# EAGLE design interfaceBoard (EAGLE 7.2.0)
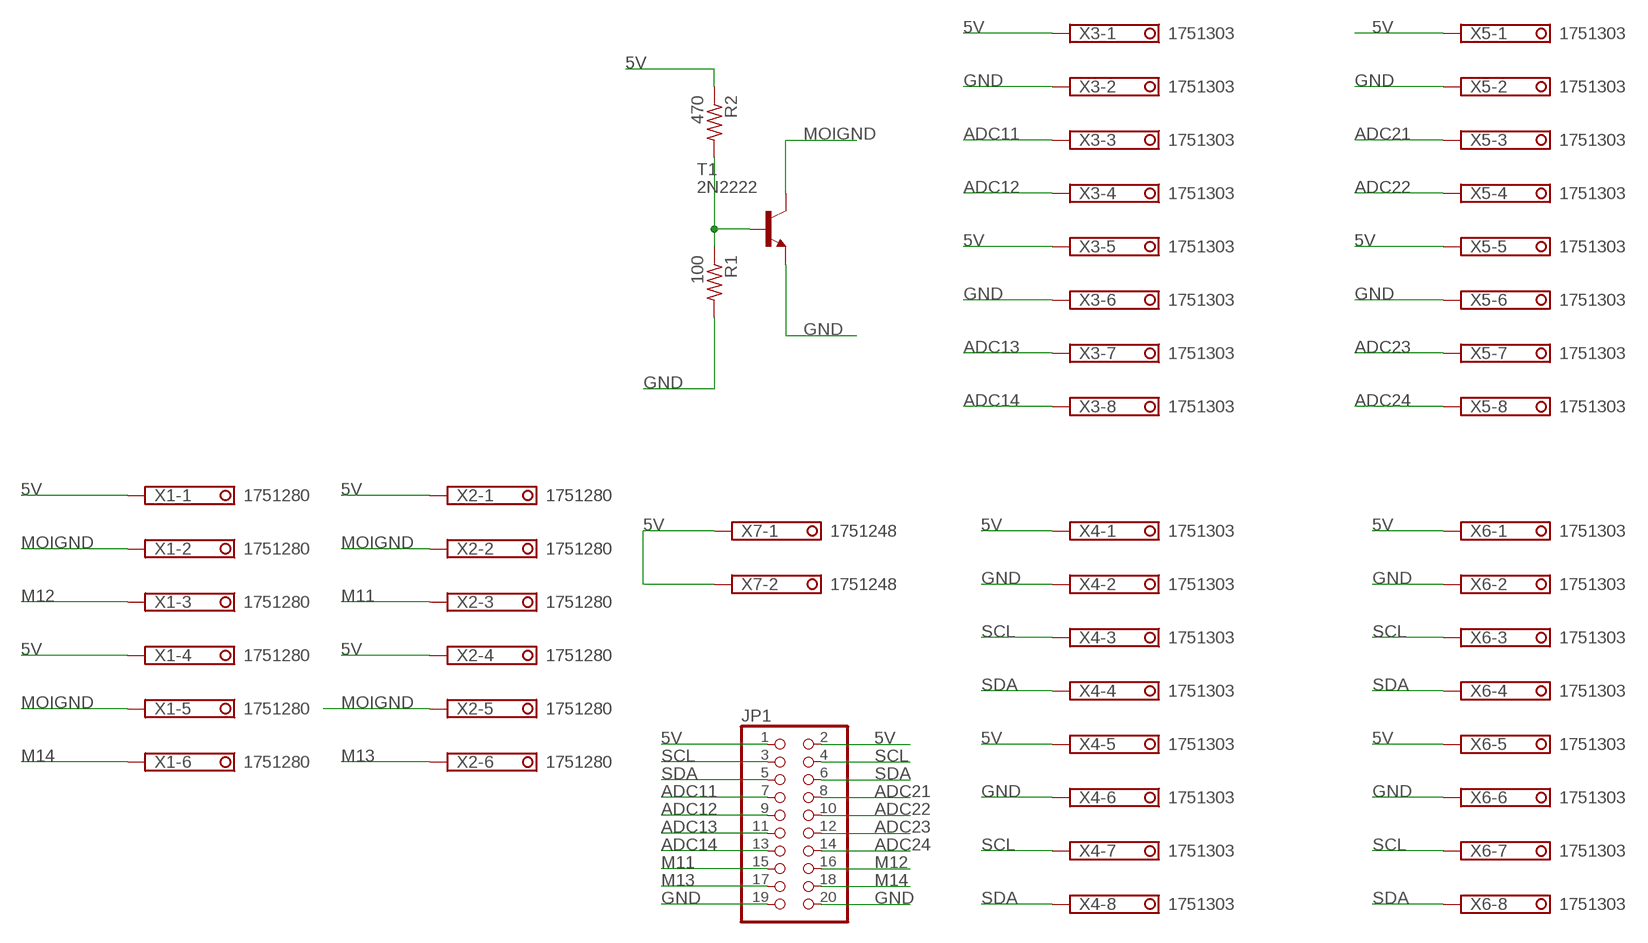
[diagram p0: schematic, sheet 1]

## Parts
JP1  PINHD-2X10  [2X10]
R1  100  R-US_M0805  [M0805]
R2  470  R-US_M0805  [M0805]
T1  2N2222  [TO92-EBC-OVAL]
X1  1751280  [1751280]
X2  1751280  [1751280]
X3  1751303  [1751303]
X4  1751303  [1751303]
X5  1751303  [1751303]
X6  1751303  [1751303]
X7  1751248  [1751248]

## Nets
5V: JP1.1 JP1.2 R2.1 X1.1 X1.4 X2.1 X2.4 X3.1 X3.5 X4.1 X4.5 X5.1 X5.5 X6.1 X6.5 X7.1 X7.2
ADC11: JP1.7 X3.3
ADC12: JP1.9 X3.4
ADC13: JP1.11 X3.7
ADC14: JP1.13 X3.8
ADC21: JP1.8 X5.3
ADC22: JP1.10 X5.4
ADC23: JP1.12 X5.7
ADC24: JP1.14 X5.8
GND: JP1.19 JP1.20 R1.2 T1.E X3.2 X3.6 X4.2 X4.6 X5.2 X5.6 X6.2 X6.6
M11: JP1.15 X2.3
M12: JP1.16 X1.3
M13: JP1.17 X2.6
M14: JP1.18 X1.6
MOIGND: T1.C X1.2 X1.5 X2.2 X2.5
N$7: R1.1 R2.2 T1.B
SCL: JP1.3 JP1.4 X4.3 X4.7 X6.3 X6.7
SDA: JP1.5 JP1.6 X4.4 X4.8 X6.4 X6.8

## Library data of the parts
JP1 = pinhead:PINHD-2X10: PIN HEADER
R1 R2 = adafruit:R-US_: RESISTOR, American symbol
T1 = adafruit:2N2222: NPN TRANSISTOR Big oval pads
X1 X2 = con-phoenix-350:1751280: MKDS 1/ 6-3,5 Printklemme Nennstrom: 10 A Bemessungsspannung: 160 V Raster: 3,5 mm Polzahl: 6 Montageart: Löten Anschlussart: Schraubanschluss Anschlussrichtung vom Leiter zur Platine: 0° Source: http://eshop.phoenixcontact.com .. 1751280.pdf; MPN: 1751280; OC_FARNELL: unknown; OC_NEWARK: 27R1765
X3-X6 = con-phoenix-350:1751303: MKDS 1/ 8-3,5 Printklemme Nennstrom: 10 A Bemessungsspannung: 160 V Raster: 3,5 mm Polzahl: 8 Montageart: Löten Anschlussart: Schraubanschluss Anschlussrichtung vom Leiter zur Platine: 0° Source: http://eshop.phoenixcontact.com .. .pdf; OC_FARNELL: unknown; OC_NEWARK: unknown
X7 = con-phoenix-350:1751248: MKDS 1/ 2-3,5 Printklemme Nennstrom: 10 A Bemessungsspannung: 160 V Raster: 3,5 mm Polzahl: 2 Montageart: Löten Anschlussart: Schraubanschluss Anschlussrichtung vom Leiter zur Platine: 0° Source: http://eshop.phoenixcontact.com .. 1751248.pdf; OC_FARNELL: unknown; OC_NEWARK: unknown

## Net classes
0 default: width 1.143 mm

## Board
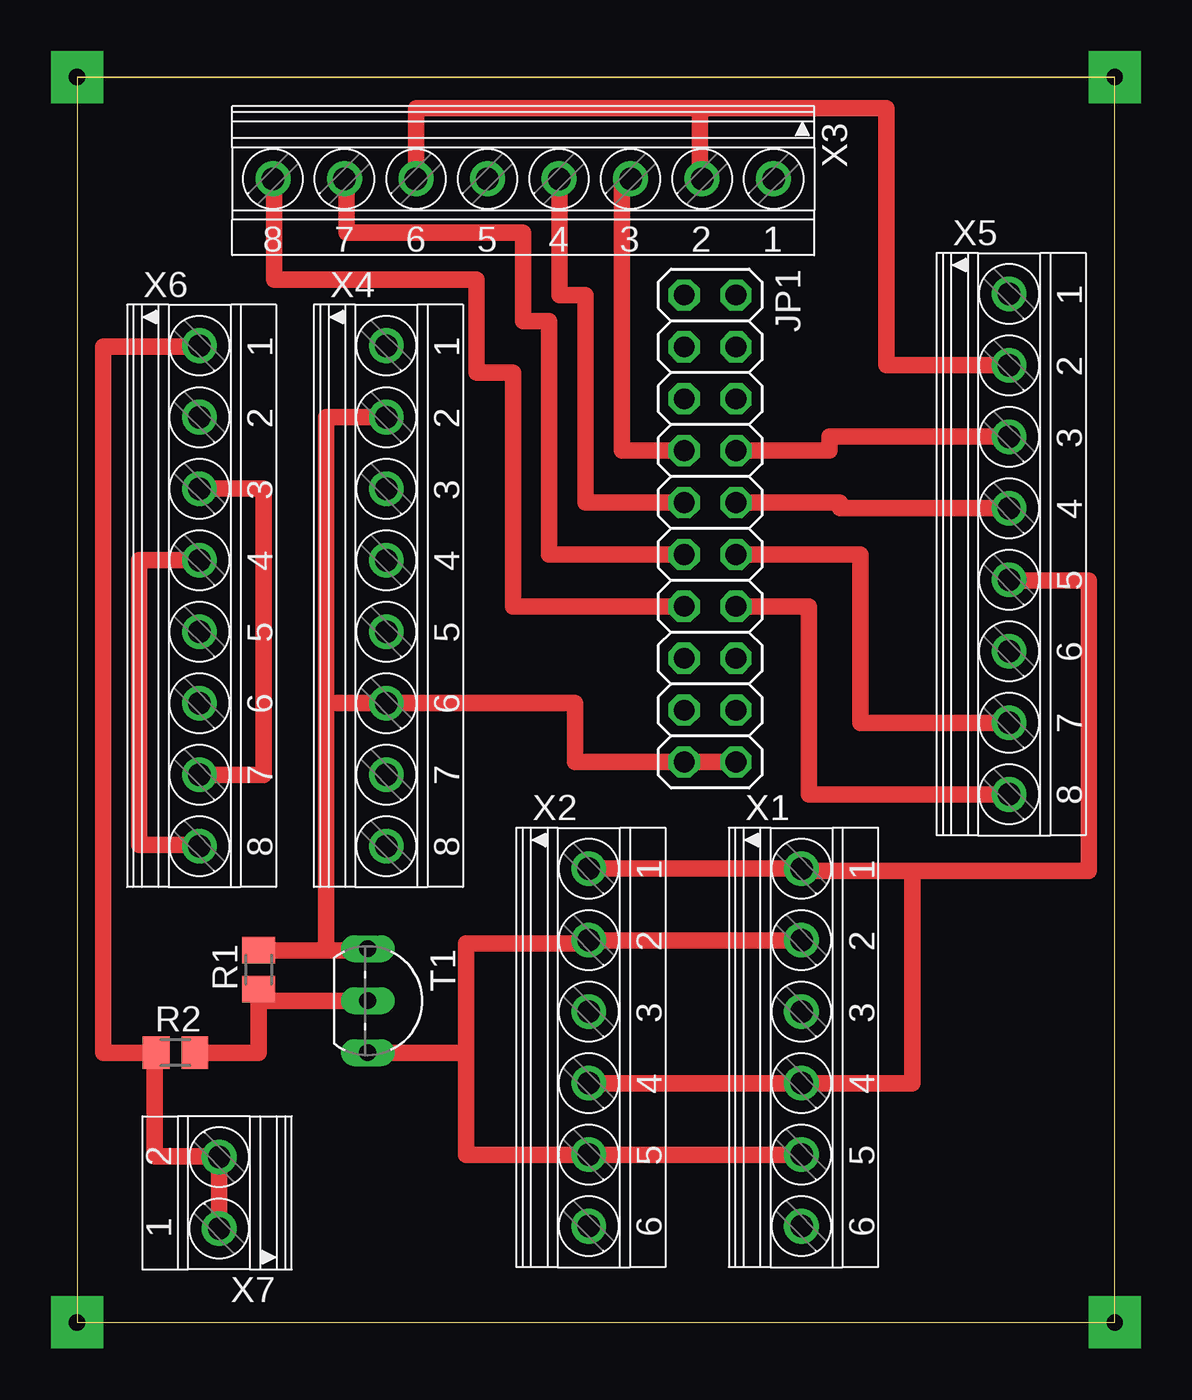
[diagram p1: board, top side]
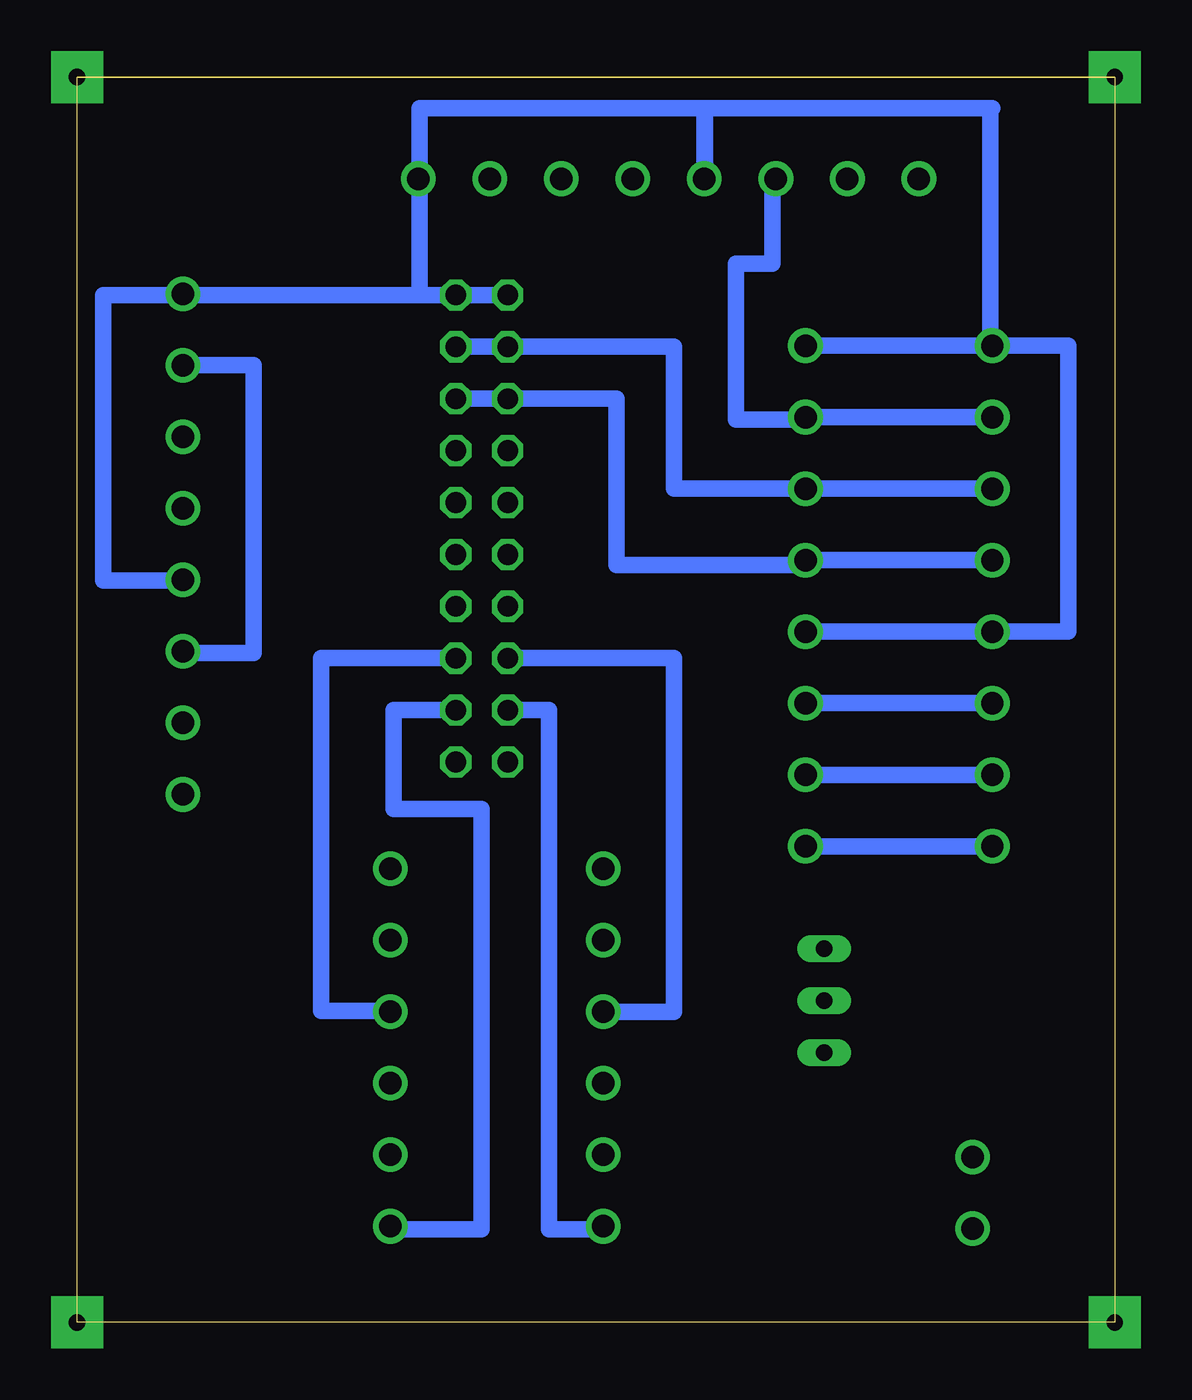
[diagram p2: board, bottom side, seen from below]

Size 50.8 x 60.96 mm. Coordinates in mm from the lower left corner, seen from the top.
Outline: 0,0 50.8,0 50.8,60.96 0,60.96 0,0
Copper layers (1*16): Top 0.035mm / dielectric 1.5mm / Bottom 0.035mm
Design rules "default": minimum track width 10mil, minimum drill 24mil, track to track 8mil, track to pad 8mil, pad to pad 8mil, via to via 8mil, smd to smd 8mil, copper to edge 40mil, drill to drill 8mil, minimum pad ring 10mil, minimum via ring 8mil, stop-mask expansion 4mil, vias tented up to drill 0mil, thermal gap 10mil

### Footprints (pad centres in the part's own frame; a part is rotated, then mirrored left to right if it is on the bottom)
2X10 = drill 1.016 octagon: 1 -11.43,-1.27; 2 -11.43,1.27; 3 -8.89,-1.27; 4 -8.89,1.27; 5 -6.35,-1.27; 6 -6.35,1.27; 7 -3.81,-1.27; 8 -3.81,1.27; 9 -1.27,-1.27; 10 -1.27,1.27; 11 1.27,-1.27; 12 1.27,1.27; 13 3.81,-1.27; 14 3.81,1.27; 15 6.35,-1.27; 16 6.35,1.27; 17 8.89,-1.27; 18 8.89,1.27; 19 11.43,-1.27; 20 11.43,1.27
M0805 = smd 1.3 x 1.6: 1 -0.95,0; 2 0.95,0
TO92-EBC-OVAL = drill 0.813 long: B 0,-1.27; C 2.54,-1.27; E -2.54,-1.27
1751280 = drill 1.1 pad 1.7: 1 -8.75,-0.1; 2 -5.25,-0.1; 3 -1.75,-0.1; 4 1.75,-0.1; 5 5.25,-0.1; 6 8.75,-0.1
1751303 = drill 1.1 pad 1.7: 1 -12.25,-0.1; 2 -8.75,-0.1; 3 -5.25,-0.1; 4 -1.75,-0.1; 5 1.75,-0.1; 6 5.25,-0.1; 7 8.75,-0.1; 8 12.25,-0.1
1751248 = drill 1.1 pad 1.7: 1 -1.75,-0.1; 2 1.75,-0.1

### Placement (x,y rotation side)
JP1  30.99,38.86 270 top
R1  8.89,17.27 90 top
R2  4.83,13.21 0 top
T1  15.49,15.75 270 top
X1  35.56,13.46 270 top
X2  25.15,13.46 270 top
X3  21.84,55.88 180 top
X4  15.24,35.56 270 top
X5  45.72,38.1 270 top
X6  6.1,35.56 270 top
X7  6.86,6.35 90 top

### Tracks (layer width: path | path; a pad name or v marks a point on that pad's centre or on a via)
5V
  Top 0.813: X7.1 X7.2 6.96,8.13 3.81,8.13 3.81,13.21 R2.1 1.27,13.21 1.27,47.75 6,47.75 X6.1 | X2.4 X1.4 40.89,11.71 40.89,22.1 | 40.89,22.1 35.46,22.1 X1.1 X2.1 | 40.89,22.1 49.53,22.1 49.53,36.32 45.62,36.32 X5.5
  Bottom 0.813: 34.04,55.98 34.04,59.44 20.09,59.44 X3.5 20.07,55.98 20.07,59.44 6.1,59.44 | 34.04,55.98 34.04,50.29 | 34.04,50.29 JP1.2 JP1.1 | 34.04,50.29 45.62,50.29 | 45.62,50.29 X5.1 | 45.62,50.29 49.53,50.29 49.53,36.32 45.62,36.32 X5.5 | X6.1 6,47.75 6.1,47.75 6.1,59.44 | X4.5 X6.5 2.29,33.81 2.29,47.81 X6.1 | 6.1,59.44 6,59.44 | X3.1 34.04,55.98 | X4.1 X6.1
ADC11
  Top 0.813: X3.3 26.67,55.98 26.67,42.67 JP1.7
ADC12
  Top 0.813: X3.4 23.62,55.98 23.62,50.29 24.89,50.29 24.89,40.13 JP1.9
ADC13
  Top 0.813: X3.7 13.21,55.98 13.21,53.34 21.84,53.34 21.84,49.02 23.11,49.02 23.11,37.59 JP1.11
ADC14
  Top 0.813: X3.8 9.65,55.98 9.65,51.05 19.56,51.05 19.56,46.48 21.34,46.48 21.34,35.05 JP1.13
ADC21
  Top 0.813: X5.3 36.83,43.35 36.83,42.67 JP1.8
ADC22
  Top 0.813: X5.4 37.34,39.85 37.34,40.13 JP1.10
ADC23
  Top 0.813: X5.7 38.35,29.35 38.35,37.59 JP1.12
ADC24
  Top 0.813: X5.8 35.81,25.85 35.81,35.05 JP1.14
GND
  Top 0.813: JP1.20 JP1.19 24.38,27.43 24.38,30.31 X4.6 12.19,30.31 | X4.2 12.19,44.31 12.19,30.31 | R1.2 12.19,18.22 | 12.19,18.22 14.22,18.22 T1.E | 12.19,30.31 12.19,18.22 | X3.2 30.48,55.98 30.48,59.44 | 30.48,59.44 16.59,59.44 X3.6 | X5.2 39.62,46.85 39.62,59.44 30.48,59.44
  Bottom 0.813: X6.2 X4.2 15.14,44.2 18.54,44.2 18.54,51.82 16.76,51.82 16.76,55.98 X3.6 | X6.6 X4.6 | X5.2 42.16,46.85 42.16,32.77 45.62,32.77 X5.6
M11
  Bottom 0.813: X2.3 21.59,15.21 21.59,32.51 JP1.15
M12
  Bottom 0.813: JP1.16 38.86,32.51 38.86,15.24 35.46,15.24 X1.3
M13
  Bottom 0.813: JP1.17 27.69,29.97 27.69,4.57 25.05,4.57 X2.6
M14
  Bottom 0.813: JP1.18 35.31,29.97 35.31,25.15 30.99,25.15 30.99,4.57 35.46,4.57 X1.6
MOIGND
  Top 0.813: 19.05,13.21 19.05,8.21 X2.5 X1.5 | 19.05,13.21 19.05,18.54 25.05,18.54 X2.2 X1.2 | T1.C 19.05,13.21
N$1  (via drill 0.8 pad 2.54)  (3 unrouted)
  other vias: 0,0 50.8,0 0,60.96 50.8,60.96
N$7
  Top 0.813: R2.2 8.89,13.21 8.89,15.75 | R1.1 8.89,15.75 | 8.89,15.75 T1.B
SCL
  Top 0.813: X6.3 9.14,40.81 9.14,26.81 X6.7
  Bottom 0.813: X6.7 X4.7 | X6.3 X4.3 21.59,40.81 21.59,47.75 JP1.3 JP1.4
SDA
  Top 0.813: X6.4 3.05,37.31 3.05,23.37 6,23.37 X6.8
  Bottom 0.813: X6.8 X4.8 | X6.4 X4.4 15.14,37.08 24.38,37.08 24.38,45.21 JP1.5 JP1.6